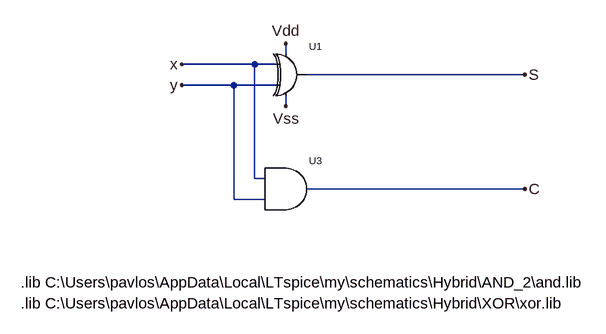
[diagram p0: schematic ha_m.asc]
ha_m.asc, the LTspice schematic file:
Version 4
SHEET 1 880 680
WIRE -256 -224 -256 -240
WIRE -304 -208 -416 -208
WIRE -272 -208 -304 -208
WIRE 112 -192 -224 -192
WIRE -336 -176 -416 -176
WIRE -272 -176 -336 -176
WIRE -256 -144 -256 -160
WIRE -304 -32 -304 -208
WIRE -288 -32 -304 -32
WIRE 112 -16 -224 -16
WIRE -336 0 -336 -176
WIRE -288 0 -336 0
FLAG 112 -192 S
FLAG 112 -16 C
FLAG -416 -208 x
FLAG -416 -176 y
FLAG -256 -144 Vss
FLAG -256 -240 Vdd
SYMBOL and -288 16 R0
SYMATTR InstName U3
SYMBOL xor -288 -160 R0
SYMATTR InstName U1
TEXT -664 128 Left 2 !.lib C:\\Users\\pavlos\\AppData\\Local\\LTspice\\my\\schematics\\Hybrid\\AND_2\\and.lib
TEXT -664 160 Left 2 !.lib C:\\Users\\pavlos\\AppData\\Local\\LTspice\\my\\schematics\\Hybrid\\XOR\\xor.lib

The netlist it stands for:
* ha_m.asc
XU3 x y C and  ; pins A B Y
XU1 x y S Vdd Vss xor  ; pins A B Y Vdd Vss
.lib C:\Users\pavlos\AppData\Local\LTspice\my\schematics\Hybrid\AND_2\and.lib
.lib C:\Users\pavlos\AppData\Local\LTspice\my\schematics\Hybrid\XOR\xor.lib
.backanno
.end